# Altium schematic sheet Schaltbox_Switch.SchDoc: Schaltbox für PC I/O - Switches
size A3; Organization: Schleißheimer GmbH; Address2: Am Kalkofen 10; Address3: D-61206 Wöllstadt; Address4: Deutschland; Revision: 1.0; SheetNumber: 2; SheetTotal: 2; PageSetup: Record=PageOptions|CenterHorizontal=True|CenterVertical=True|PrintScale=0.70|XCorrection=1.00|YCorrection=1.00|PrintKind=0|BorderSize=5000000|LeftOffset=0|BottomOffset=0|Orientation=2|PaperLength=1000|PaperWidth=1000|Scale=100|PaperSource=7|PrintQuality=-4|MediaType=1|DitherType=10|PrintScaleMode=1|PaperKind=A4|PaperIndex=9; ProjectName: Remote AP
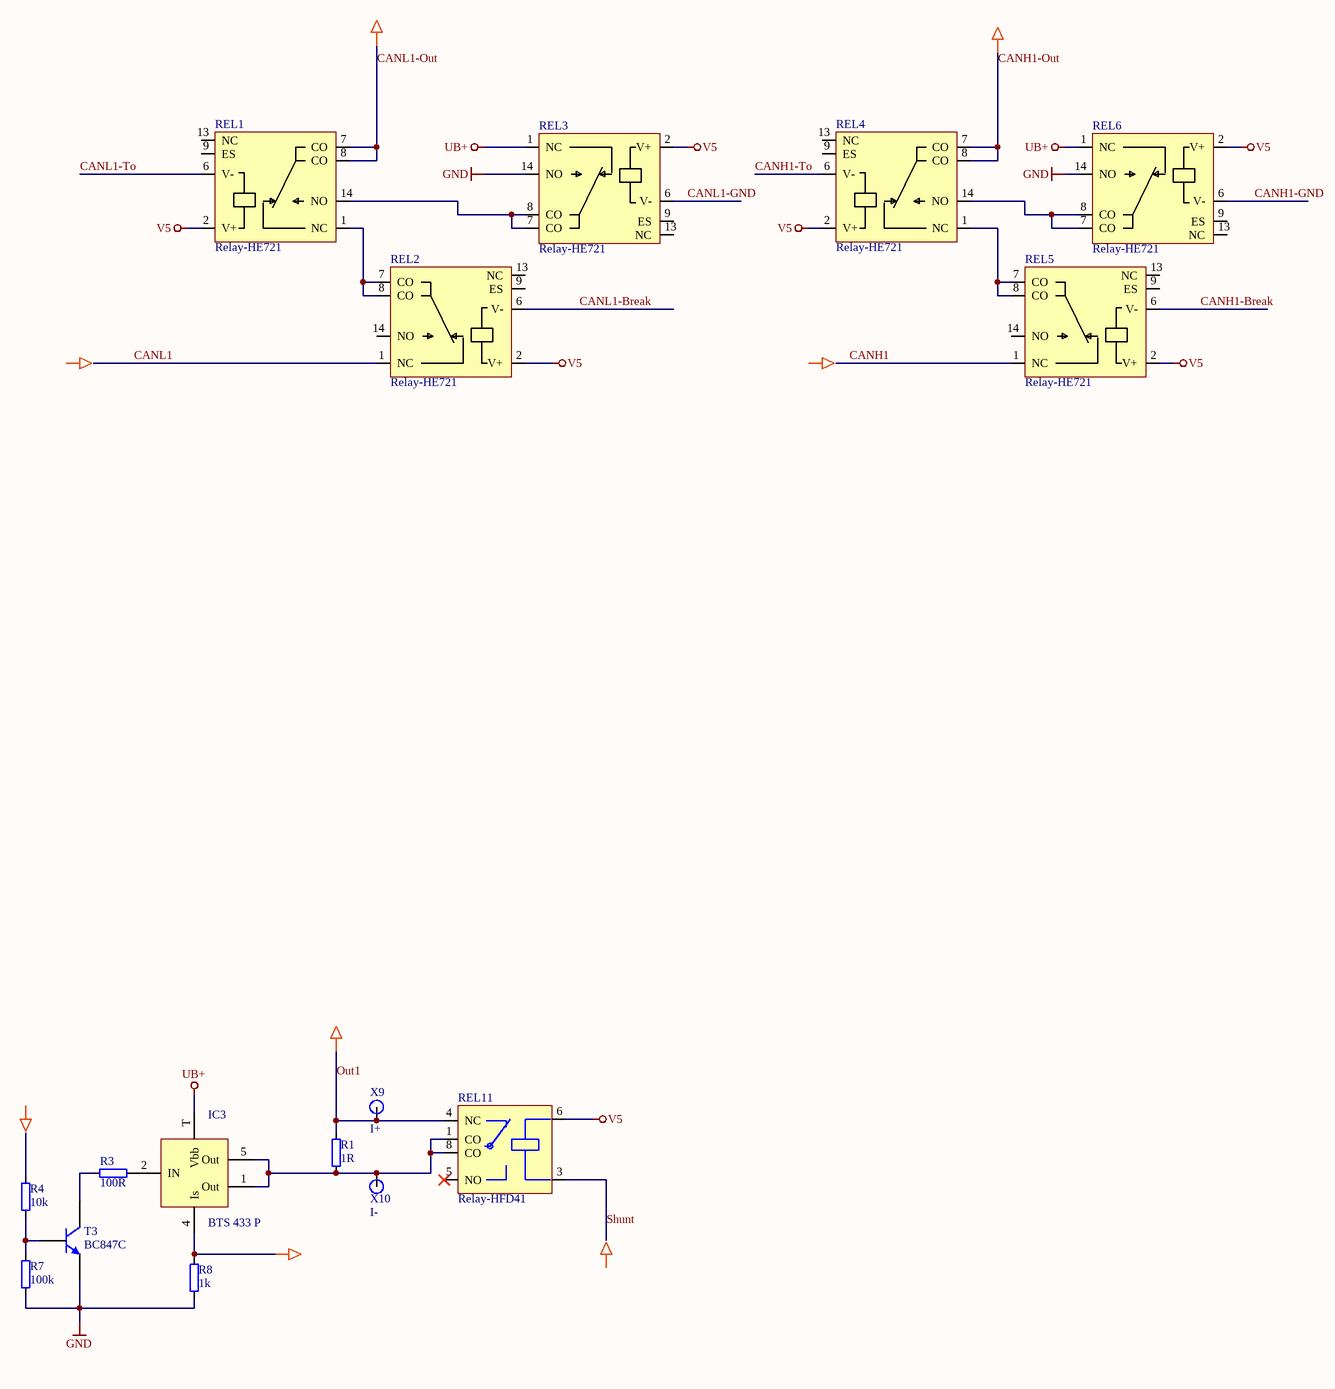
[diagram p0: Schaltbox_Switch.SchDoc]

## Parts
(Parts that share a designator on the sheet are numbered #1, #2 ... from top to bottom, then left to right.)
*#1  Pfeil-->  (value not drawn)  (graphical)
*#2  Pfeil-->  (value not drawn)  (graphical)
*#3  Pfeil-->  (value not drawn)  (graphical)
*#4  Pfeil-->  (value not drawn)  (graphical)
*#5  Pfeil-->  (value not drawn)  (graphical)
*#6  Pfeil-->  (value not drawn)  (graphical)
*#7  Pfeil-->  (value not drawn)  (graphical)
*#8  Pfeil-->  (value not drawn)  (graphical)
IC3  BTS 433 P  [TO252-5_MD_(DPAK)]
R1  1R  [R2512HD]
R3  100R  [R0603HD]
R4  10k  [R0603HD]
R7  100k  [R0603HD]
R8  1k  [R0603HD]
REL1  Relay-HE721  [DIP14 - HE700]
REL2  Relay-HE721  [DIP14 - HE700]
REL3  Relay-HE721  [DIP14 - HE700]
REL4  Relay-HE721  [DIP14 - HE700]
REL5  Relay-HE721  [DIP14 - HE700]
REL6  Relay-HE721  [DIP14 - HE700]
REL11  Relay-HFD41  [REL_HFD41]
T3  BC847C  [SOT23_L]
X9  I+  [Loetoese-3.2]
X10  I-  [Loetoese-3.2]

## Nets
GND: R7.1 R8.1 REL3.14(NO) REL6.14(NO) T3.2(E)
UB+: IC3.T(Vbb) REL3.1(NC) REL6.1(NC)
V5: REL1.2(V+) REL2.2(V+) REL3.2(V+) REL4.2(V+) REL5.2(V+) REL6.2(V+) REL11.6
CANH1: REL5.1(NC)
CANH1-Break: REL5.6(V-)
CANH1-GND: REL6.6(V-)
CANH1-Out: REL4.7(CO) REL4.8(CO)
CANH1-To: REL4.6(V-)
CANL1: REL2.1(NC)
CANL1-Break: REL2.6(V-)
CANL1-GND: REL3.6(V-)
CANL1-Out: REL1.7(CO) REL1.8(CO)
CANL1-To: REL1.6(V-)
Out1: R1.2 REL11.4(NC) X9.1
Shunt: REL11.3
NetIC3_1: IC3.1(Out) IC3.5(Out) R1.1 REL11.1(CO) REL11.8(CO) X10.1
NetIC3_2: IC3.2(IN) R3.1
NetIC3_4: IC3.4(Is) R8.2
NetR3_2: R3.2 T3.3(C)
NetR4_1: R4.1 R7.2 T3.1(B)
NetREL1_1: REL1.1(NC) REL2.7(CO) REL2.8(CO)
NetREL1_14: REL1.14(NO) REL3.7(CO) REL3.8(CO)
NetREL4_1: REL4.1(NC) REL5.7(CO) REL5.8(CO)
NetREL4_14: REL4.14(NO) REL6.7(CO) REL6.8(CO)

Not connected (* = marked no-connect by the designer): R4 2; REL1 9(ES) 13(NC); REL2 9(ES) 13(NC) 14(NO); REL3 9(ES) 13(NC); REL4 9(ES) 13(NC); REL5 9(ES) 13(NC) 14(NO); REL6 9(ES) 13(NC); REL11 5(NO)*

## Notes on the sheet
- Title
- Size:
- Date:
- A3
- Number:
- Time:
- Revision:
- Sheet
- of
- File:

## Library data of the parts
*#1-*#8 = Pfeil-->: No Footprint
IC3 = BTS443 P
R1 R3 R4 R7 R8 = Res: Resistor
  R3: VALUE: 100R
  R4: VALUE: 10k
  R7: VALUE: 100k
  R8: VALUE: 1k
REL1-REL6 = Relay-HE721: Hamlin Reed-Relay SPDT
REL11 = Relay-HFD41: Relay Hongfa Typ HFD41, SPDT, 2A/ 250VAC/30VDC
T3 = BC847C: NPN General-purpose Transistor; Published: 17-Sep-2003; LatestRevisionDate: 12-Dec-2006; LatestRevisionNote: IPC-7351 Footprint Added.; DatasheetVersion: 4-Feb-2002; PackageVersion: May-1999; PackageReference: SOT23; Publisher: Altium Limited; PackageDescription: 3-Pin SOT-23 Package 0.95 mm Pitch, 2.3 mm Lead Span; ComponentLink1Description: Manufacturer Link; ComponentLink1URL: http://www.semiconductors.philips.com/; ComponentLink2Description: Datasheet; ComponentLink2URL: http://www.semiconductors.philips.com/acrobat/datasheets/BC846_BC847_BC848_5.pdf
X9 X10 = Anschlusspin: Anschluss, Bohrung 1.2mm